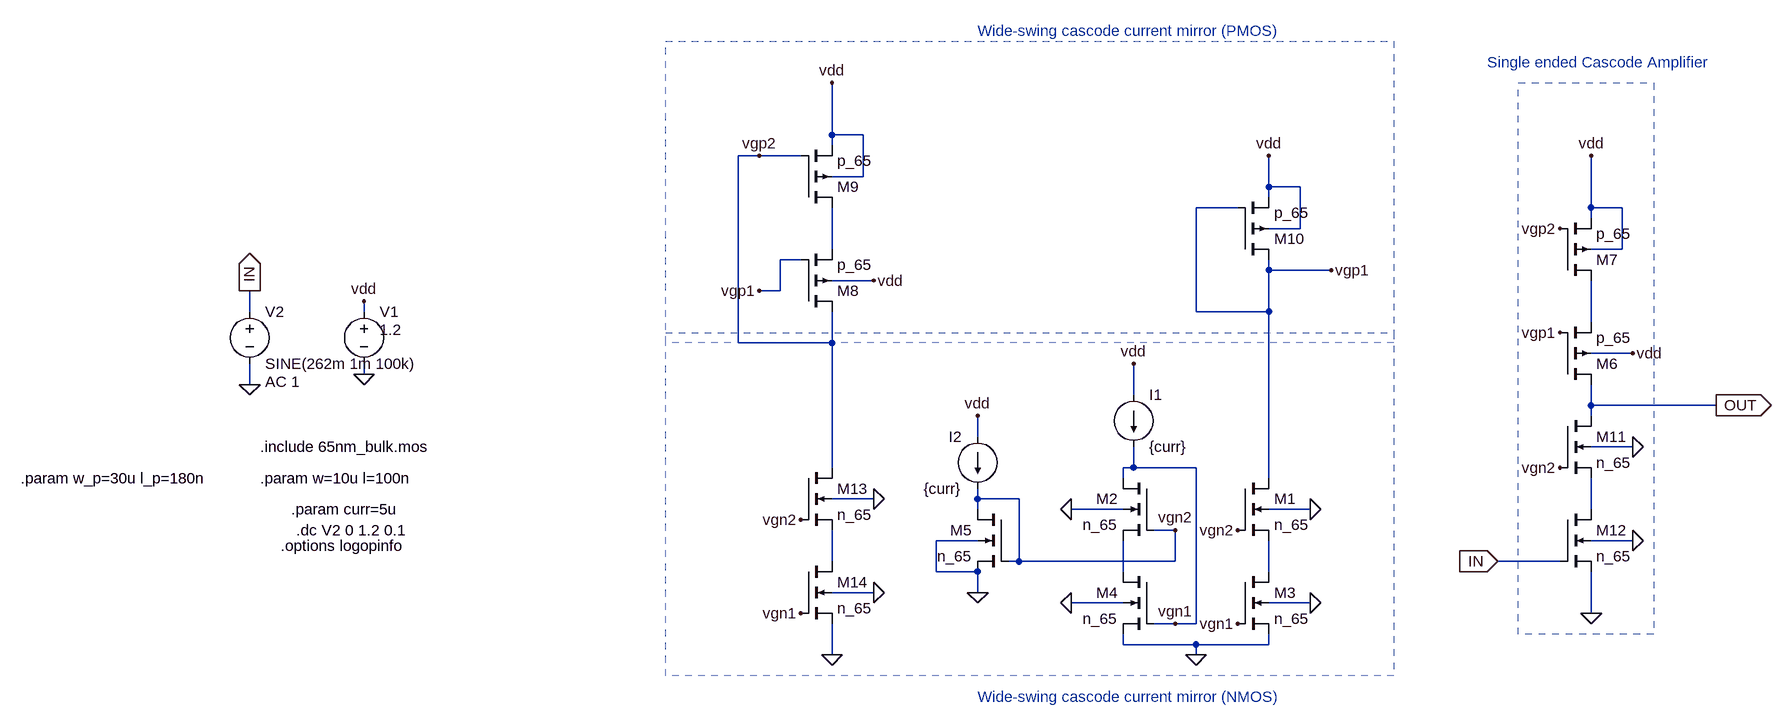
[diagram p0: schematic Cascode_OTA_2.asc]
Cascode_OTA_2.asc, the LTspice schematic file:
Version 4.1
SHEET 1 1148 768
WIRE -320 -112 -320 -192
WIRE -272 -112 -320 -112
WIRE -320 -96 -320 -112
WIRE -432 -80 -464 -80
WIRE -368 -80 -432 -80
WIRE -272 -48 -272 -112
WIRE -272 -48 -320 -48
WIRE 352 -32 352 -80
WIRE 400 -32 352 -32
WIRE 352 -16 352 -32
WIRE 304 0 240 0
WIRE 848 0 848 -80
WIRE 896 0 848 0
WIRE 848 16 848 0
WIRE 400 32 400 -32
WIRE 400 32 352 32
WIRE -320 64 -320 0
WIRE 896 64 896 0
WIRE 896 64 848 64
WIRE -368 80 -400 80
WIRE 352 96 352 80
WIRE 448 96 352 96
WIRE -256 112 -320 112
WIRE -400 128 -400 80
WIRE -400 128 -432 128
WIRE -1216 160 -1216 128
WIRE -1040 160 -1040 144
WIRE 240 160 240 0
WIRE 352 160 352 96
WIRE 352 160 240 160
WIRE 848 176 848 112
WIRE -464 208 -464 -80
WIRE -320 208 -320 160
WIRE -320 208 -464 208
WIRE 912 224 848 224
WIRE -1040 256 -1040 240
WIRE -1216 272 -1216 240
WIRE 144 288 144 240
WIRE 848 304 848 272
WIRE 1040 304 848 304
WIRE 848 320 848 304
WIRE -96 352 -96 320
WIRE 912 368 848 368
WIRE -320 400 -320 208
WIRE 144 400 144 368
WIRE 144 400 128 400
WIRE 240 400 144 400
WIRE 128 416 128 400
WIRE 352 416 352 160
WIRE -256 448 -320 448
WIRE -96 448 -96 432
WIRE -32 448 -96 448
WIRE -96 464 -96 448
WIRE 128 464 48 464
WIRE 416 464 352 464
WIRE 848 464 848 416
WIRE 208 496 176 496
WIRE -96 512 -160 512
WIRE 912 512 848 512
WIRE -320 544 -320 496
WIRE -32 544 -32 448
WIRE -32 544 -48 544
WIRE 208 544 208 496
WIRE 208 544 -32 544
WIRE 800 544 704 544
WIRE -160 560 -160 512
WIRE -96 560 -160 560
WIRE 128 560 128 512
WIRE 352 560 352 512
WIRE -256 592 -320 592
WIRE -96 592 -96 560
WIRE 128 608 48 608
WIRE 416 608 352 608
WIRE 848 624 848 560
WIRE 208 640 176 640
WIRE 240 640 240 400
WIRE 240 640 208 640
WIRE 128 672 128 656
WIRE 240 672 128 672
WIRE 352 672 352 656
WIRE 352 672 240 672
WIRE -320 688 -320 640
WIRE 240 688 240 672
FLAG -1040 256 0
FLAG -1040 144 vdd
FLAG 48 608 0
FLAG 240 688 0
FLAG 48 464 0
FLAG 416 464 0
FLAG -96 320 vdd
FLAG -96 592 0
FLAG 416 608 0
FLAG 848 -80 vdd
FLAG 912 224 vdd
FLAG 208 496 vgn2
FLAG 208 640 vgn1
FLAG -320 -192 vdd
FLAG -256 112 vdd
FLAG 352 -80 vdd
FLAG 304 640 vgn1
FLAG 304 496 vgn2
FLAG 912 368 0
FLAG 912 512 0
FLAG 800 400 vgn2
FLAG 848 624 0
FLAG -432 128 vgp1
FLAG -432 -80 vgp2
FLAG 800 32 vgp2
FLAG 800 192 vgp1
FLAG 1040 304 OUT
IOPIN 1040 304 Out
FLAG 704 544 IN
IOPIN 704 544 In
FLAG -256 448 0
FLAG -256 592 0
FLAG -368 624 vgn1
FLAG -368 480 vgn2
FLAG -320 688 0
FLAG 144 240 vdd
FLAG 448 96 vgp1
FLAG -1216 272 0
FLAG -1216 128 IN
IOPIN -1216 128 Out
SYMBOL nmos4 304 416 R0
SYMATTR InstName M1
SYMATTR Value n_65
SYMATTR Value2 l={l} w={w}
SYMBOL nmos4 176 416 M0
SYMATTR InstName M2
SYMATTR Value n_65
SYMATTR Value2 l={l} w={w}
SYMBOL current 144 288 R0
WINDOW 123 0 0 Left 0
WINDOW 39 0 0 Left 0
SYMATTR InstName I1
SYMATTR Value {curr}
SYMBOL voltage -1040 144 R0
WINDOW 3 24 44 Left 2
WINDOW 123 0 0 Left 0
WINDOW 39 0 0 Left 0
SYMATTR Value 1.2
SYMATTR InstName V1
SYMBOL nmos4 304 560 R0
SYMATTR InstName M3
SYMATTR Value n_65
SYMATTR Value2 l=100n w=10u
SYMBOL nmos4 176 560 M0
SYMATTR InstName M4
SYMATTR Value n_65
SYMATTR Value2 l={l} w={w}
SYMBOL current -96 352 M0
WINDOW 123 0 0 Left 0
WINDOW 39 0 0 Left 0
SYMATTR InstName I2
SYMATTR Value {curr}
SYMBOL nmos4 -48 464 M0
SYMATTR InstName M5
SYMATTR Value n_65
SYMATTR Value2 l={l} w={w/4}
SYMBOL pmos4 800 272 M180
SYMATTR InstName M6
SYMATTR Value p_65
SYMATTR Value2 l={l_p} w={w_p}
SYMBOL pmos4 800 112 M180
SYMATTR InstName M7
SYMATTR Value p_65
SYMATTR Value2 l={l_p} w={w_p}
SYMBOL pmos4 -368 160 M180
SYMATTR InstName M8
SYMATTR Value p_65
SYMATTR Value2 l={l_p} w={w_p}
SYMBOL pmos4 -368 0 M180
SYMATTR InstName M9
SYMATTR Value p_65
SYMATTR Value2 l={l_p} w={w_p}
SYMBOL pmos4 304 80 M180
SYMATTR InstName M10
SYMATTR Value p_65
SYMATTR Value2 l={l_p} w={w_p/4}
SYMBOL nmos4 800 320 R0
SYMATTR InstName M11
SYMATTR Value n_65
SYMATTR Value2 l={l} w={w}
SYMBOL nmos4 800 464 R0
SYMATTR InstName M12
SYMATTR Value n_65
SYMATTR Value2 l={l} w={w}
SYMBOL nmos4 -368 400 R0
SYMATTR InstName M13
SYMATTR Value n_65
SYMATTR Value2 l={l} w={w}
SYMBOL nmos4 -368 544 R0
SYMATTR InstName M14
SYMATTR Value n_65
SYMATTR Value2 l={l} w={w}
SYMBOL voltage -1216 144 R0
WINDOW 123 24 124 Left 2
WINDOW 39 0 0 Left 0
SYMATTR Value2 AC 1
SYMATTR InstName V2
SYMATTR Value SINE(262m 1m 100k)
TEXT -1200 368 Left 2 !.include 65nm_bulk.mos
TEXT -96 752 Left 2 ;Wide-swing cascode current mirror (NMOS)
TEXT -96 -272 Left 2 ;Wide-swing cascode current mirror (PMOS)
TEXT 688 -224 Left 2 ;Single ended Cascode Amplifier
TEXT -1152 464 Left 2 !.param curr=5u
TEXT -1568 416 Left 2 !.param w_p=30u l_p=180n
TEXT -1200 416 Left 2 !.param w=10u l=100n
TEXT -1168 520 Left 2 !.options logopinfo
TEXT -1144 496 Left 2 !.dc V2 0 1.2 0.1
RECTANGLE Normal 944 656 736 -192 2
RECTANGLE Normal 544 208 -576 -256 2
RECTANGLE Normal 544 720 -576 192 2

The netlist it stands for:
* Cascode_OTA_2.asc
M1 vgp1 vgn2 N006 0 n_65 l={l} w={w}
M2 vgn1 vgn2 N005 0 n_65 l={l} w={w}
I1 vdd vgn1 {curr}
V1 vdd 0 1.2
M3 N006 vgn1 0 0 n_65 l=100n w=10u
M4 N005 vgn1 0 0 n_65 l={l} w={w}
I2 vdd vgn2 {curr}
M5 vgn2 vgn2 0 0 n_65 l={l} w={w/4}
M6 OUT vgp1 N002 vdd p_65 l={l_p} w={w_p}
M7 N002 vgp2 vdd vdd p_65 l={l_p} w={w_p}
M8 vgp2 vgp1 N001 vdd p_65 l={l_p} w={w_p}
M9 N001 vgp2 vdd vdd p_65 l={l_p} w={w_p}
M10 vgp1 vgp1 vdd vdd p_65 l={l_p} w={w_p/4}
M11 OUT vgn2 N003 0 n_65 l={l} w={w}
M12 N003 IN 0 0 n_65 l={l} w={w}
M13 vgp2 vgn2 N004 0 n_65 l={l} w={w}
M14 N004 vgn1 0 0 n_65 l={l} w={w}
V2 IN 0 SINE(262m 1m 100k) AC 1
.model NMOS NMOS
.model PMOS PMOS
.lib standard.mos
.include 65nm_bulk.mos
* Wide-swing cascode current mirror (NMOS)
* Wide-swing cascode current mirror (PMOS)
* Single ended Cascode Amplifier
.param curr=5u
.param w_p=30u l_p=180n
.param w=10u l=100n
.options logopinfo
.dc V2 0 1.2 0.1
.backanno
.end